# Altium schematic sheet M3.SchDoc
size A
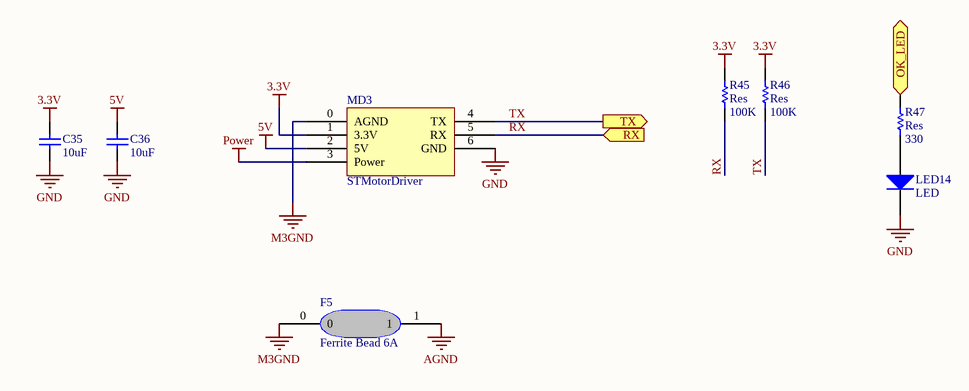
[diagram p0: M3.SchDoc]

## Parts
C35  value 10uF  [2012[0805]]  (hidden comment: Cap_UP)
C36  value 10uF  [2012[0805]]  (hidden comment: Cap_UP)
F5  Ferrite Bead 6A  [f6A]
LED14  LED  [2012[0805]]
MD3  STMotorDriver  [MotorDriver]
R45  Res  value 100K  [2012[0805]]
R46  Res  value 100K  [2012[0805]]
R47  Res  value 330  [2012[0805]]

## Ports
OK_LED (in), RX (in), TX (out)

## Nets
3.3V: C35.2 MD3.1(3.3V) R45.2 R46.2
5V: C36.2 MD3.2(5V)
AGND: F5.1
GND: C35.1 C36.1 LED14.2(K) MD3.6(GND)
M3GND: F5.0 MD3.0(AGND)
Power: MD3.3(Power)
OK_LED: R47.1 ; port OK_LED
RX: MD3.5(RX) R45.1 ; port RX
TX: MD3.4(TX) R46.1 ; port TX
NetLED14_1: LED14.1(A) R47.2

## Library data of the parts
C35 C36 = Cap_UP: Capacitor; Published: 8-Jun-2000; LatestRevisionDate: 17-Jul-2002; LatestRevisionNote: Re-released for DXP Platform.; PackageReference: RAD-0.3; Publisher: Altium Limited
F5 = F6A
LED14 = Diode: 1 Amp General Purpose Rectifier; Revision 1: 11-Jul-2000: SIM Model Added.; Revision 2: 17-Jul-2002: Re-released for DXP Platform.; Package Information: Latest Revision: Aug-1999; Code - JEDEC: DO-204-AL; Published: 8-Jun-2000; Datasheet: Latest Revision: 1998; Package Reference: DO-41; Publisher: Altium Limited
R45-R47 = Res: Semiconductor Resistor; Published: 8-Jun-2000; LatestRevisionDate: 17-Jul-2002; LatestRevisionNote: Re-released for DXP Platform.; PackageReference: AXIAL-0.5; Publisher: Altium Limited